# Altium schematic sheet RFID_PCB_Antenna_Revisions.SchDoc
size A4
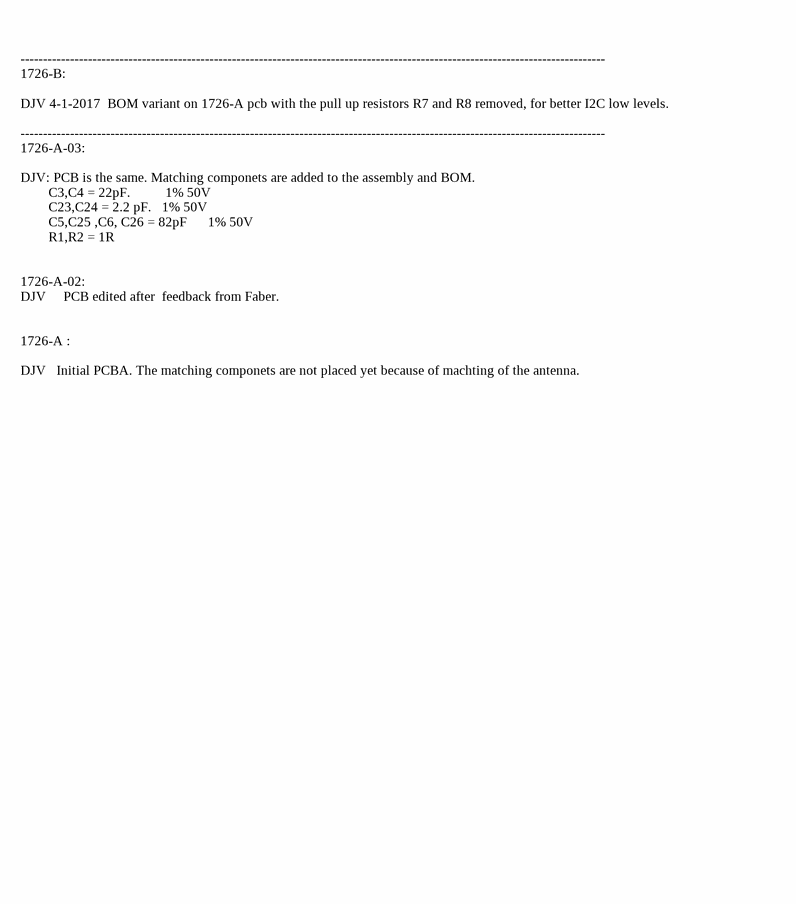
[diagram p0: RFID_PCB_Antenna_Revisions.SchDoc]

## Notes on the sheet
- ----------------------------------------------------------------------------------------------------------------------------------
  1726-B:
  DJV 4-1-2017  BOM variant on 1726-A pcb with the pull up resistors R7 and R8 removed, for better I2C low levels.
  ----------------------------------------------------------------------------------------------------------------------------------
  1726-A-03:
  DJV: PCB is the same. Matching componets are added to the assembly and BOM.
  C3,C4 = 22pF.          1% 50V
  C23,C24 = 2.2 pF.   1% 50V
  C5,C25 ,C6, C26 = 82pF      1% 50V
  R1,R2 = 1R
  1726-A-02:
  DJV     PCB edited after  feedback from Faber.
  1726-A :
  DJV   Initial PCBA. The matching componets are not placed yet because of machting of the antenna.